# EAGLE design scld_winslow (EAGLE 6.4)
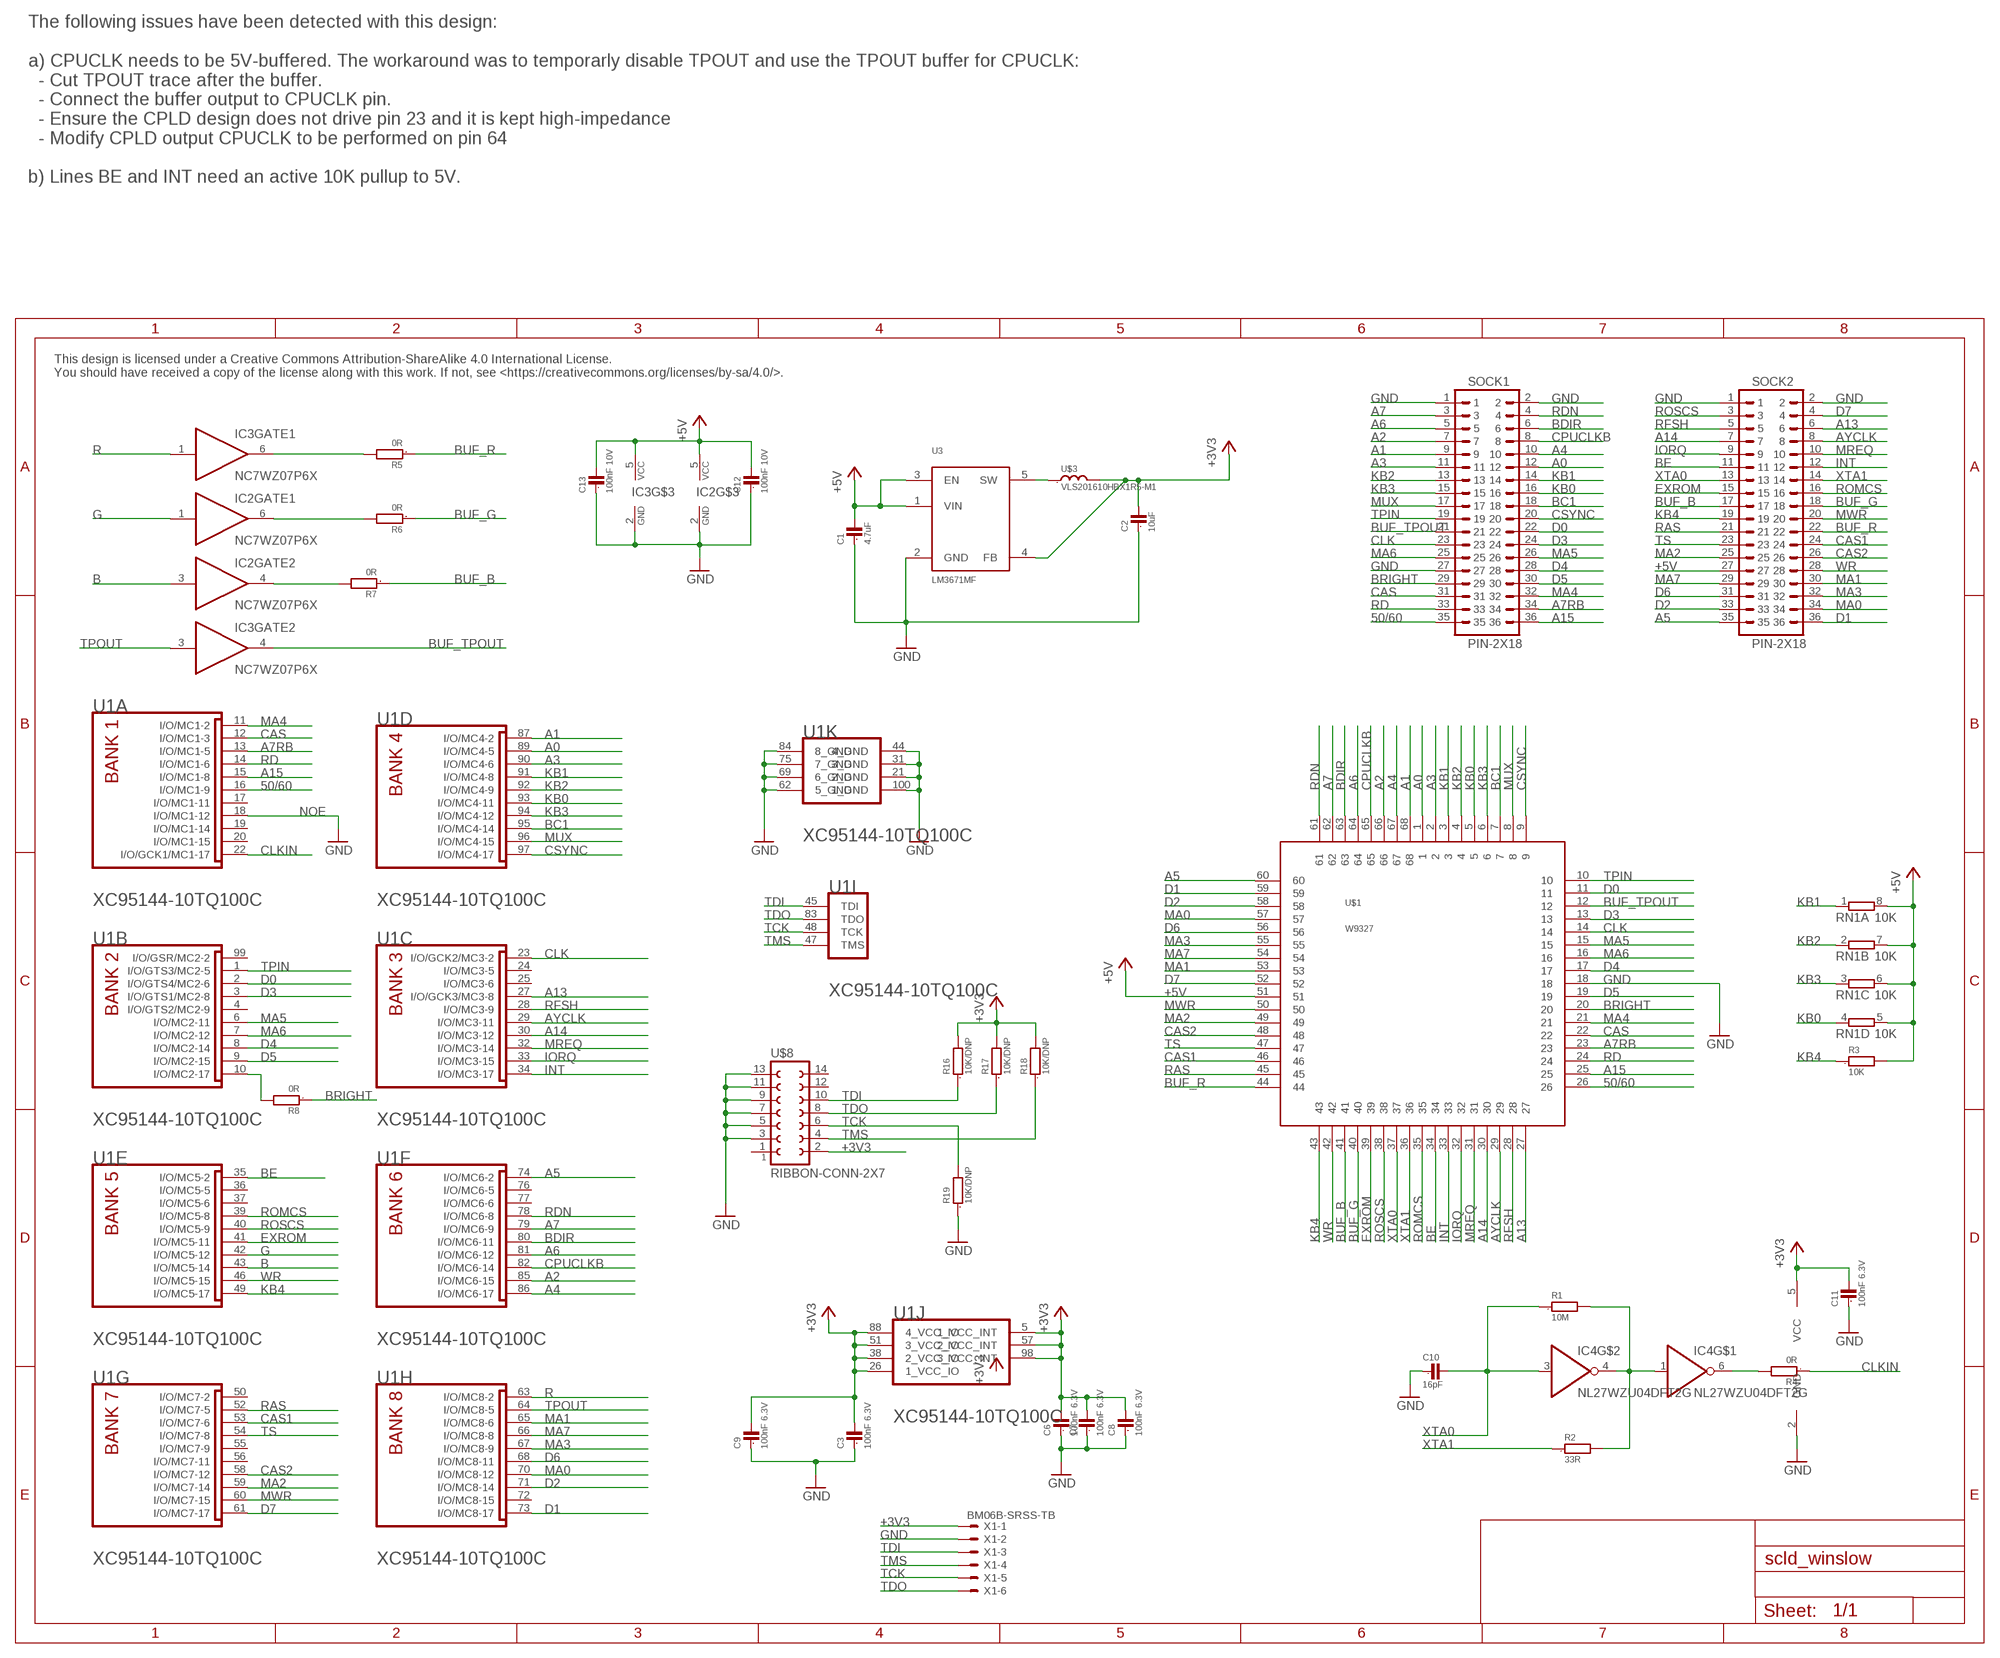
[diagram p0: schematic, sheet 1]

## Parts
C1  4.7uF  C0805  [0805]
C2  10uF  C0805  [0805]
C3  100nF 6.3V  C0402  [0402]
C6  100nF 6.3V  C0402  [0402]
C7  100nF 6.3V  C0402  [0402]
C8  100nF 6.3V  C0402  [0402]
C9  100nF 6.3V  C0402  [0402]
C10  16pF  C0402  [0402]
C11  100nF 6.3V  C0402  [0402]
C12  100nF 10V  C0402  [0402]
C13  100nF 10V  C0402  [0402]
IC2  NC7WZ07P6X  [SC70-6]
IC3  NC7WZ07P6X  [SC70-6]
IC4  NL27WZU04DFT2G  [SC70-6]
R1  10M  R0402  [0402]
R2  33R  R0402  [0402]
R3  10K  R0402  [0402]
R4  0R  R0603  [0603]
R5  0R  R0603  [0603]
R6  0R  R0603  [0603]
R7  0R  R0603  [0603]
R8  0R  R0603  [0603]
R16  10K/DNP  R0603  [0603]
R17  10K/DNP  R0603  [0603]
R18  10K/DNP  R0603  [0603]
R19  10K/DNP  R0603  [0603]
RN1  10K  4R-NEXB28V  [EXB28V]
SOCK1  PIN-2X18  [PIN-2X18]
SOCK2  PIN-2X18  [PIN-2X18]
U1  XILINX_XC95144-10TQ100CLQFP  [LQFP100]
U3  LM3671MF  [SOT23-5L]
U$1  W9327  [W9327]
U$3  VLS201610HBX1R5-M1  [IND_0806]
U$8  RIBBON-CONN-2X7  [RIBBON-CONN-2X7]
X1  BM06B-SRSS-TB  [BM06B-SRSS-TB]

## Nets
50/60: SOCK1.35 U1.16(A:I/O/MC1-9) U$1.26
+3V3: C2.2 C3.2 C6.2 C7.2 C8.2 C9.2 C11.2 IC4.5(VCC) R16.2 R17.2 R18.2 U1.5(J:1_VCC_INT) U1.26(J:1_VCC_IO) U1.38(J:2_VCC_IO) U1.51(J:3_VCC_IO) U1.57(J:2_VCC_INT) U1.88(J:4_VCC_IO) U1.98(J:3_VCC_INT) U3.4(FB) U$3.P$2 U$8.2 X1.1
+5V: C1.2 C12.2 C13.2 IC2.5(VCC) IC3.5(VCC) R3.2 RN1.5 RN1.6 RN1.7 RN1.8 SOCK2.27 U3.1(VIN) U3.3(EN) U$1.51
A0: SOCK1.12 U1.89(D:I/O/MC4-5) U$1.1
A1: SOCK1.9 U1.87(D:I/O/MC4-2) U$1.68
A2: SOCK1.7 U1.85(F:I/O/MC6-15) U$1.66
A3: SOCK1.11 U1.90(D:I/O/MC4-6) U$1.2
A4: SOCK1.10 U1.86(F:I/O/MC6-17) U$1.67
A5: SOCK2.35 U1.74(F:I/O/MC6-2) U$1.60
A6: SOCK1.5 U1.81(F:I/O/MC6-12) U$1.64
A7: SOCK1.3 U1.79(F:I/O/MC6-9) U$1.62
A7RB: SOCK1.34 U1.13(A:I/O/MC1-5) U$1.23
A13: SOCK2.6 U1.27(C:I/O/GCK3/MC3-8) U$1.27
A14: SOCK2.7 U1.30(C:I/O/MC3-12) U$1.30
A15: SOCK1.36 U1.15(A:I/O/MC1-8) U$1.25
AYCLK: SOCK2.8 U1.29(C:I/O/MC3-11) U$1.29
B: IC2.3(GATE2:I) U1.43(E:I/O/MC5-14)
BC1: SOCK1.18 U1.95(D:I/O/MC4-14) U$1.7
BDIR: SOCK1.6 U1.80(F:I/O/MC6-11) U$1.63
BE: SOCK2.11 U1.35(E:I/O/MC5-2) U$1.34
BRIGHT: R8.1 SOCK1.29 U$1.20
BUF_B: R7.1 SOCK2.17 U$1.41
BUF_G: R6.1 SOCK2.18 U$1.40
BUF_R: R5.1 SOCK2.22 U$1.44
BUF_TPOUT: IC3.4(GATE2:O) SOCK1.21 U$1.12
CAS: SOCK1.31 U1.12(A:I/O/MC1-3) U$1.22
CAS1: SOCK2.24 U1.53(G:I/O/MC7-6) U$1.46
CAS2: SOCK2.26 U1.58(G:I/O/MC7-12) U$1.48
CLK: SOCK1.23 U1.23(C:I/O/GCK2/MC3-2) U$1.14
CLKIN: R4.1 U1.22(A:I/O/GCK1/MC1-17)
CPUCLKB: SOCK1.8 U1.82(F:I/O/MC6-14) U$1.65
CSYNC: SOCK1.20 U1.97(D:I/O/MC4-17) U$1.9
D0: SOCK1.22 U1.2(B:I/O/GTS4/MC2-6) U$1.11
D1: SOCK2.36 U1.73(H:I/O/MC8-17) U$1.59
D2: SOCK2.33 U1.71(H:I/O/MC8-14) U$1.58
D3: SOCK1.24 U1.3(B:I/O/GTS1/MC2-8) U$1.13
D4: SOCK1.28 U1.8(B:I/O/MC2-14) U$1.17
D5: SOCK1.30 U1.9(B:I/O/MC2-15) U$1.19
D6: SOCK2.31 U1.68(H:I/O/MC8-11) U$1.56
D7: SOCK2.4 U1.61(G:I/O/MC7-17) U$1.52
EXROM: SOCK2.15 U1.41(E:I/O/MC5-11) U$1.39
G: IC2.1(GATE1:I) U1.42(E:I/O/MC5-12)
GND: C1.1 C2.1 C3.1 C6.1 C7.1 C8.1 C9.1 C10.1 C11.1 C12.1 C13.1 IC2.2(GND) IC3.2(GND) IC4.2(GND) R19.1 SOCK1.1 SOCK1.2 SOCK1.27 SOCK2.1 SOCK2.2 U1.18(A:I/O/MC1-12) U1.21(K:2_GND) U1.31(K:3_GND) U1.44(K:4_GND) U1.62(K:5_GND) U1.69(K:6_GND) U1.75(K:7_GND) U1.84(K:8_GND) U1.100(K:1_GND) U3.2(GND) U$1.18 U$8.3 U$8.5 U$8.7 U$8.9 U$8.11 U$8.13 X1.2
INT: SOCK2.12 U1.34(C:I/O/MC3-17) U$1.33
IORQ: SOCK2.9 U1.33(C:I/O/MC3-15) U$1.32
KB0: RN1.4 SOCK1.16 U1.93(D:I/O/MC4-11) U$1.5
KB1: RN1.1 SOCK1.14 U1.91(D:I/O/MC4-8) U$1.3
KB2: RN1.2 SOCK1.13 U1.92(D:I/O/MC4-9) U$1.4
KB3: RN1.3 SOCK1.15 U1.94(D:I/O/MC4-12) U$1.6
KB4: R3.1 SOCK2.19 U1.49(E:I/O/MC5-17) U$1.43
MA0: SOCK2.34 U1.70(H:I/O/MC8-12) U$1.57
MA1: SOCK2.30 U1.65(H:I/O/MC8-6) U$1.53
MA2: SOCK2.25 U1.59(G:I/O/MC7-14) U$1.49
MA3: SOCK2.32 U1.67(H:I/O/MC8-9) U$1.55
MA4: SOCK1.32 U1.11(A:I/O/MC1-2) U$1.21
MA5: SOCK1.26 U1.6(B:I/O/MC2-11) U$1.15
MA6: SOCK1.25 U1.7(B:I/O/MC2-12) U$1.16
MA7: SOCK2.29 U1.66(H:I/O/MC8-8) U$1.54
MREQ: SOCK2.10 U1.32(C:I/O/MC3-14) U$1.31
MUX: SOCK1.17 U1.96(D:I/O/MC4-15) U$1.8
MWR: SOCK2.20 U1.60(G:I/O/MC7-15) U$1.50
N$1: IC4.6(O) R4.2
N$2: R8.2 U1.10(B:I/O/MC2-17)
N$3: IC3.6(GATE1:O) R5.2
N$4: U3.5(SW) U$3.P$1
N$5: IC4.1(I) IC4.4(O) R1.2 R2.2
N$7: IC2.4(GATE2:O) R7.2
N$8: IC2.6(GATE1:O) R6.2
R: IC3.1(GATE1:I) U1.63(H:I/O/MC8-2)
RAS: SOCK2.21 U1.52(G:I/O/MC7-5) U$1.45
RD: SOCK1.33 U1.14(A:I/O/MC1-6) U$1.24
RDN: SOCK1.4 U1.78(F:I/O/MC6-8) U$1.61
RFSH: SOCK2.5 U1.28(C:I/O/MC3-9) U$1.28
ROMCS: SOCK2.16 U1.39(E:I/O/MC5-8) U$1.35
ROSCS: SOCK2.3 U1.40(E:I/O/MC5-9) U$1.38
TCK: R19.2 U1.48(I:TCK) U$8.6 X1.5
TDI: R16.1 U1.45(I:TDI) U$8.10 X1.3
TDO: R17.1 U1.83(I:TDO) U$8.8 X1.6
TMS: R18.1 U1.47(I:TMS) U$8.4 X1.4
TPIN: SOCK1.19 U1.1(B:I/O/GTS3/MC2-5) U$1.10
TPOUT: IC3.3(GATE2:I) U1.64(H:I/O/MC8-5)
TS: SOCK2.23 U1.54(G:I/O/MC7-8) U$1.47
WR: SOCK2.28 U1.46(E:I/O/MC5-15) U$1.42
XTA0: C10.2 IC4.3(I) R1.1 SOCK2.13 U$1.37
XTA1: R2.1 SOCK2.14 U$1.36
Unconnected: U1.4(B:I/O/GTS2/MC2-9) U1.17(A:I/O/MC1-11) U1.19(A:I/O/MC1-14) U1.20(A:I/O/MC1-15) U1.24(C:I/O/MC3-5) U1.25(C:I/O/MC3-6) U1.36(E:I/O/MC5-5) U1.37(E:I/O/MC5-6) U1.50(G:I/O/MC7-2) U1.55(G:I/O/MC7-9) U1.56(G:I/O/MC7-11) U1.72(H:I/O/MC8-15) U1.76(F:I/O/MC6-5) U1.77(F:I/O/MC6-6) U1.99(B:I/O/GSR/MC2-2) U$8.1 U$8.12 U$8.14

## Notes on the sheet
- The following issues have been detected with this design:
  
  a) CPUCLK needs to be 5V-buffered. The workaround was to temporarly disable TPOUT and use the TPOUT buffer for CPUCLK:
    - Cut TPOUT trace after the buffer.
    - Connect the buffer output to CPUCLK pin.
    - Ensure the CPLD design does not drive pin 23 and it is kept high-impedance
    - Modify CPLD output CPUCLK to be performed on pin 64
  
  b) Lines BE and INT need an active 10K pullup to 5V.
- This design is licensed under a Creative Commons Attribution-ShareAlike 4.0 International License.
  You should have received a copy of the license along with this work. If not, see <https://creativecommons.org/licenses/by-sa/4.0/>.
- NOE

## Library data of the parts
C1-C3 C6-C13 = GadgetFactory:C: CAPACITOR, European symbol
IC2 IC3 = GadgetFactory:NC7WZ07P6X: Dual line drivers with 3-state outputs.
IC4 = alvie:NL27WZU04
R1-R8 R16-R19 = GadgetFactory:R: RESISTOR, European symbol
RN1 = resistor-dil:4R-N: Array Chip Resistor Source: RS Component / Phycomp; OC_FARNELL: unknown; OC_NEWARK: unknown
SOCK1 SOCK2 = alvie:PIN-2X18
U1 = Xilinx - XC95144-10TQ100C:XILINX_XC95144-10TQ100C: PLD-XC9K-XC95144-SQ100A
U3 = alvie:LM3671
U$1 = alvie:W9327
U$3 = alvie:VLS201610HBX
U$8 = alvie:RIBBON-CONN-2X7
X1 = con-jst2:?M06B-SRSS-TB: Disconnectable Crimp style connector, 1.0mm pitch 6 contacts

## Board
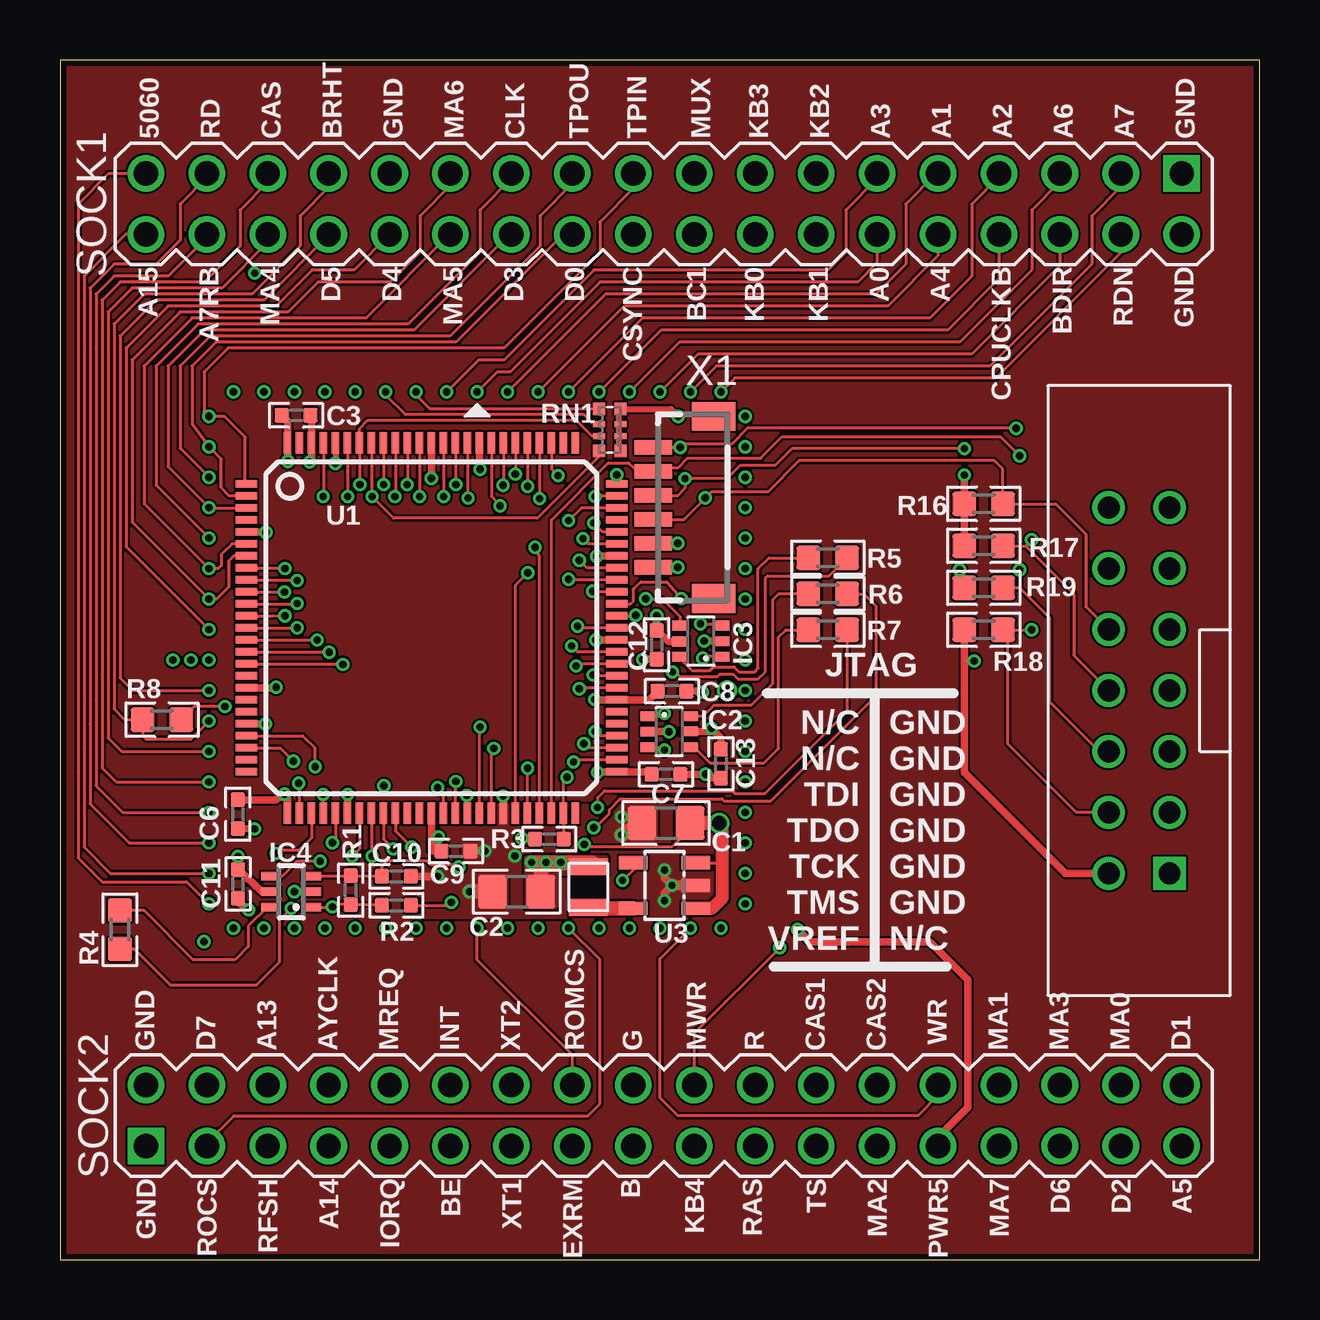
[diagram p1: board, top side]
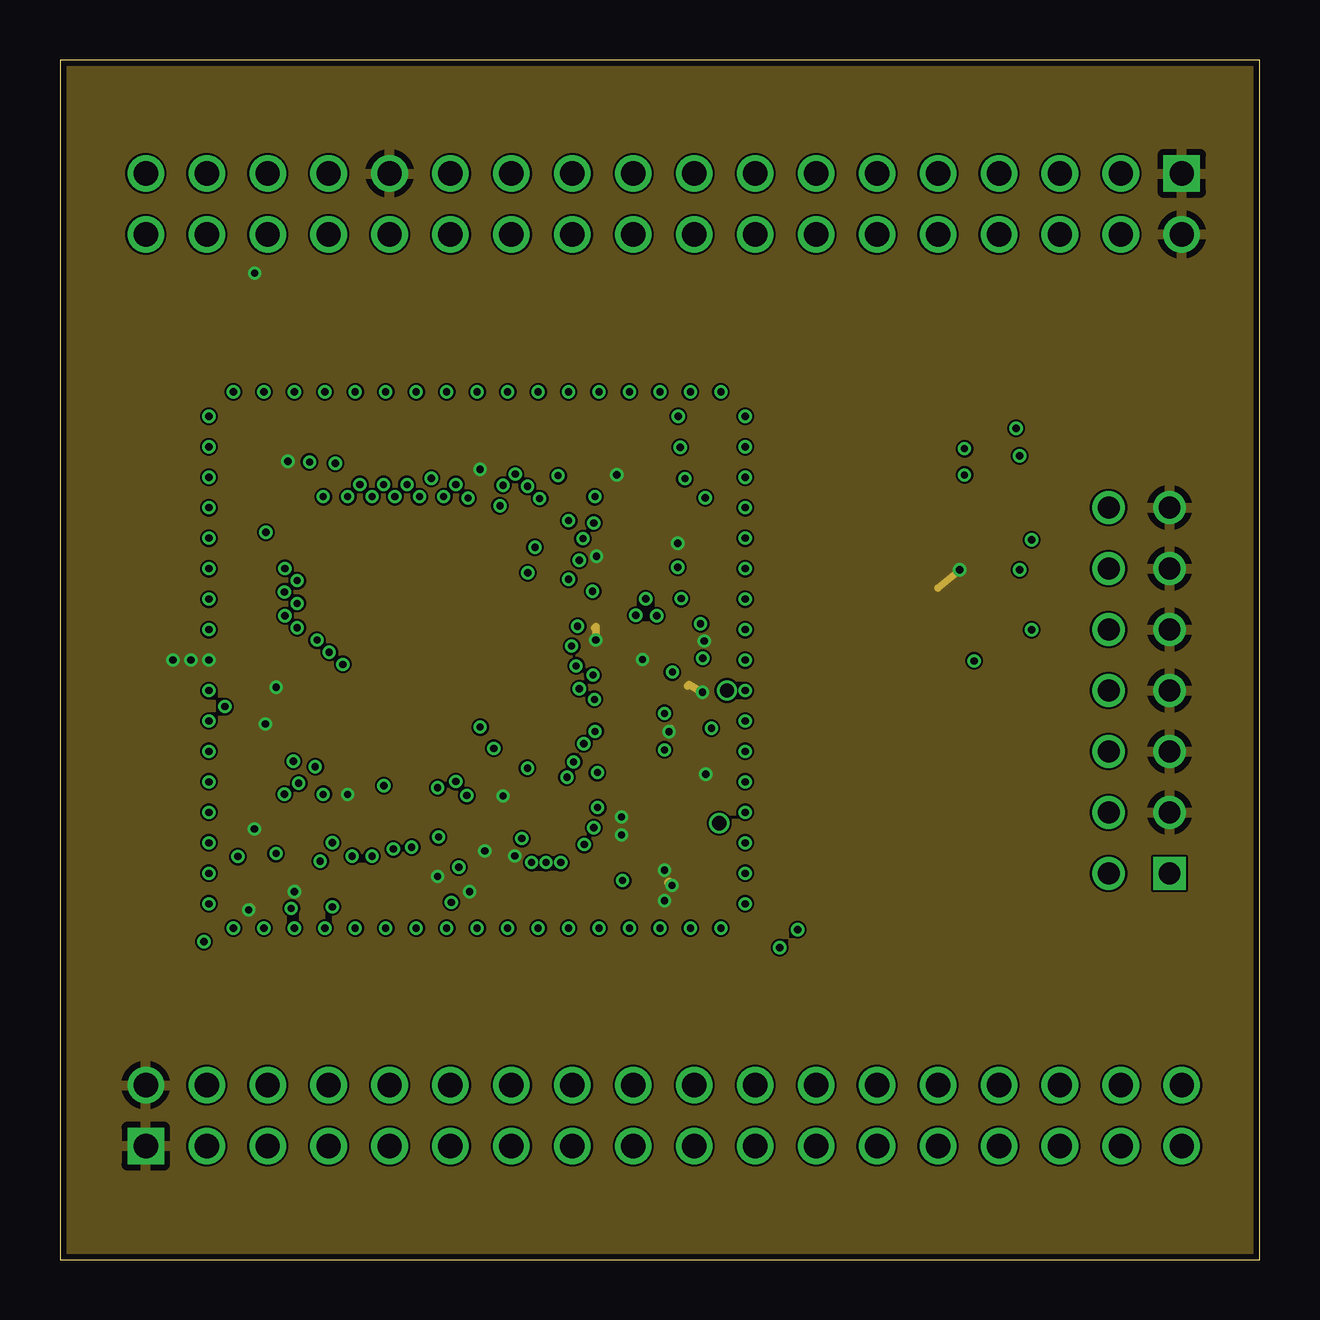
[diagram p2: board, inner layer Route2]
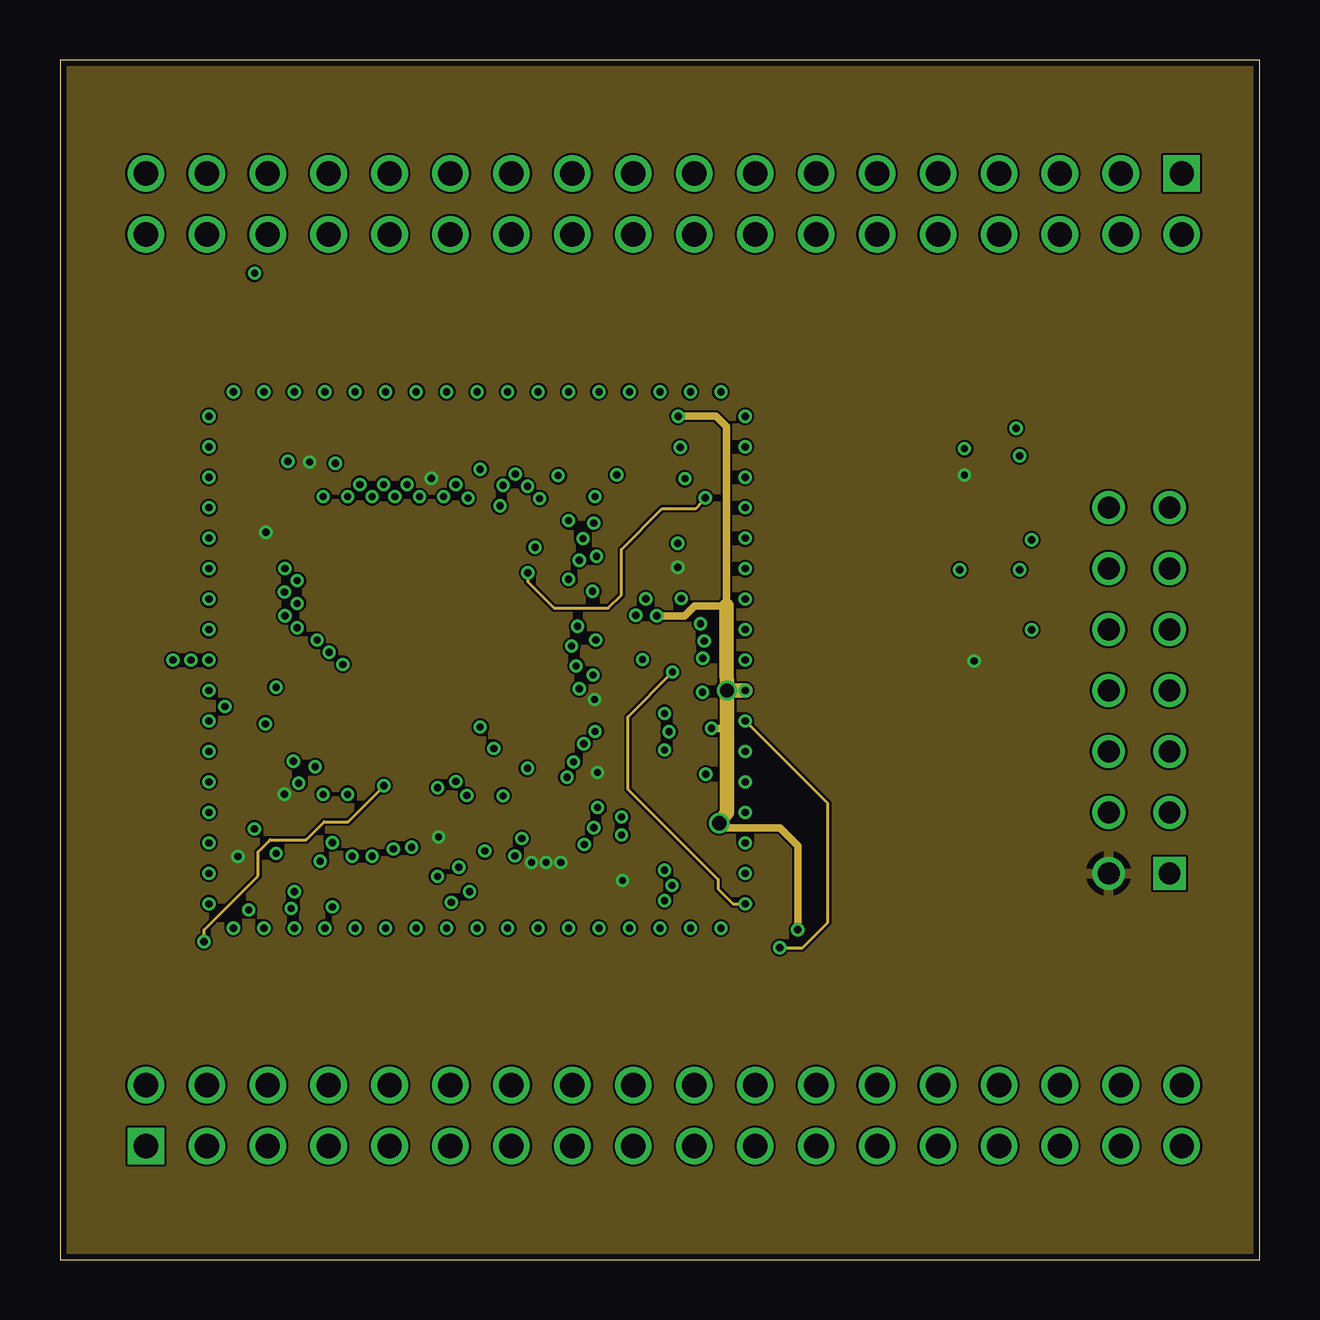
[diagram p3: board, inner layer Route15]
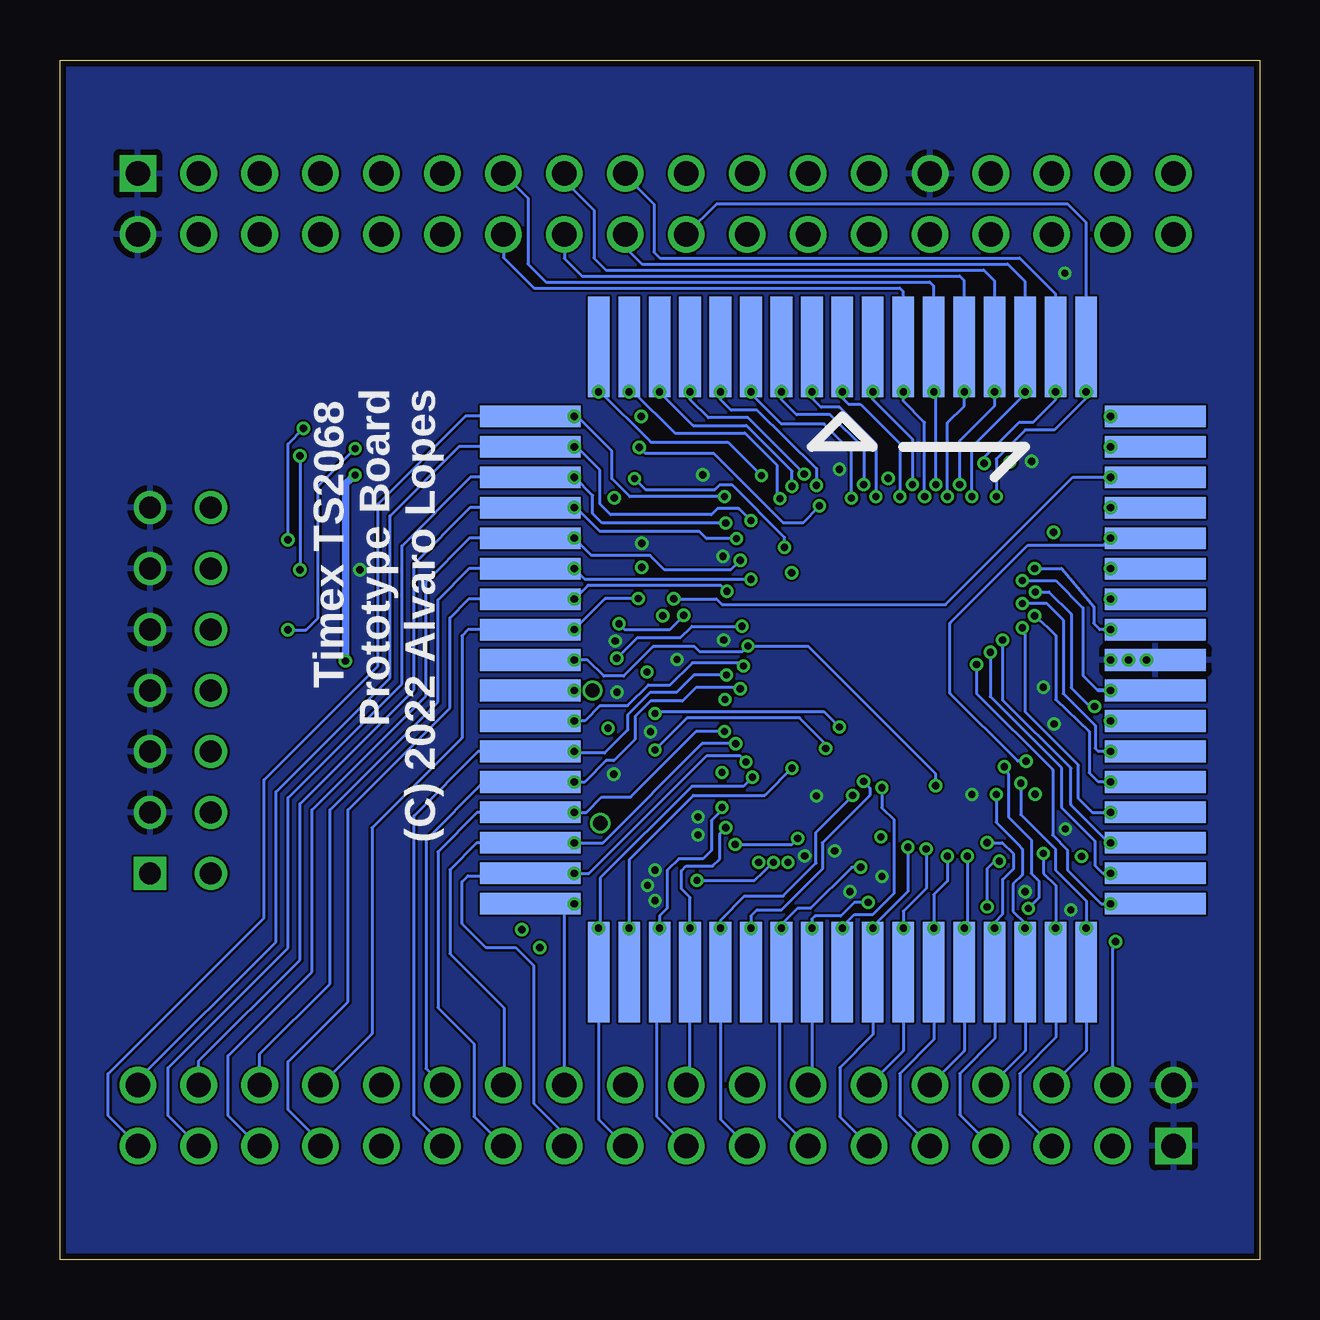
[diagram p4: board, bottom side, seen from below]

Size 50 x 50 mm. Coordinates in mm from the lower left corner, seen from the top.
Outline: 0,0 50,0 50,50 0,50 0,0
Copper layers (1*2*15*16): Top 0.035mm / dielectric 0.18mm / Route2 0.017mm / dielectric 1.12mm / Route15 0.017mm / dielectric 0.18mm / Bottom 0.035mm
Design rules "JLCPCB-FourLayerLayer *": minimum track width 3.5mil, minimum drill 0.2mm, track to track 3.5mil, track to pad 5mil, pad to pad 5mil, via to via 5mil, smd to smd 0mil, copper to edge 10mil, drill to drill 10mil, minimum pad ring 0.15mm, minimum via ring 0.125mm, stop-mask expansion 2mil, vias tented up to drill 100mil, thermal gap 10mil

### Footprints (pad centres in the part's own frame; a part is rotated, then mirrored left to right if it is on the bottom)
0805 = smd 1.2 x 1.4: 1 -1,0; 2 1,0
0402 = smd 0.6 x 0.6: 1 -0.6,0; 2 0.6,0
SC70-6 = smd 0.4 x 0.7: 1 -0.65,-0.85; 2 0,-0.85; 3 0.65,-0.85; 4 0.65,0.85; 5 -0.015,0.85; 6 -0.65,0.85
SC70-6' = smd 0.35 x 0.8: 1 -0.65,-0.85; 2 0,-0.85; 3 0.65,-0.85; 4 0.65,0.85; 5 0,0.85; 6 -0.65,0.85
0603 = smd 1 x 1: 1 -0.8,0; 2 0.8,0
EXB28V = smd 0.525 x 0.5: 1 -0.875,-0.45; 4 0.875,-0.45; 5 0.875,0.45; 8 -0.875,0.45 | smd 0.25 x 0.5: 2 -0.25,-0.45; 3 0.25,-0.45; 6 0.25,0.45; 7 -0.25,0.45
PIN-2X18 = drill 1.016 square: 1 -22.86,-1.27 | drill 1.016: 2 -22.86,1.27; 3 -20.32,-1.27; 4 -20.32,1.27; 5 -17.78,-1.27; 6 -17.78,1.27; 7 -15.24,-1.27; 8 -15.24,1.27; 9 -12.7,-1.27; 10 -12.7,1.27; 11 -10.16,-1.27; 12 -10.16,1.27; 13 -7.62,-1.27; 14 -7.62,1.27; 15 -5.08,-1.27; 16 -5.08,1.27; 17 -2.54,-1.27; 18 -2.54,1.27; 19 0,-1.27; 20 0,1.27; 21 2.54,-1.27; 22 2.54,1.27; 23 5.08,-1.27; 24 5.08,1.27; 25 7.62,-1.27; 26 7.62,1.27; 27 10.16,-1.27; 28 10.16,1.27; 29 12.7,-1.27; 30 12.7,1.27; 31 15.24,-1.27; 32 15.24,1.27; 33 17.78,-1.27; 34 17.78,1.27; 35 20.32,-1.27; 36 20.32,1.27
LQFP100 = smd 0.9 x 0.3: 1 -7.72,6; 2 -7.72,5.5; 3 -7.72,5; 4 -7.72,4.5; 5 -7.72,4; 6 -7.72,3.5; 7 -7.72,3; 8 -7.72,2.5; 9 -7.72,2; 10 -7.72,1.5; 11 -7.72,1; 12 -7.72,0.5; 13 -7.72,0; 14 -7.72,-0.5; 15 -7.72,-1; 16 -7.72,-1.5; 17 -7.72,-2; 18 -7.72,-2.5; 19 -7.72,-3; 20 -7.72,-3.5; 21 -7.72,-4; 22 -7.72,-4.5; 23 -7.72,-5; 24 -7.72,-5.5; 25 -7.72,-6; 51 7.72,-6; 52 7.72,-5.5; 53 7.72,-5; 54 7.72,-4.5; 55 7.72,-4; 56 7.72,-3.5; 57 7.72,-3; 58 7.72,-2.5; 59 7.72,-2; 60 7.72,-1.5; 61 7.72,-1; 62 7.72,-0.5; 63 7.72,0; 64 7.72,0.5; 65 7.72,1; 66 7.72,1.5; 67 7.72,2; 68 7.72,2.5; 69 7.72,3; 70 7.72,3.5; 71 7.72,4; 72 7.72,4.5; 73 7.72,5; 74 7.72,5.5; 75 7.72,6 | smd 0.3 x 0.9: 26 -6,-7.72; 27 -5.5,-7.72; 28 -5,-7.72; 29 -4.5,-7.72; 30 -4,-7.72; 31 -3.5,-7.72; 32 -3,-7.72; 33 -2.5,-7.72; 34 -2,-7.72; 35 -1.5,-7.72; 36 -1,-7.72; 37 -0.5,-7.72; 38 0,-7.72; 39 0.5,-7.72; 40 1,-7.72; 41 1.5,-7.72; 42 2,-7.72; 43 2.5,-7.72; 44 3,-7.72; 45 3.5,-7.72; 46 4,-7.72; 47 4.5,-7.72; 48 5,-7.72; 49 5.5,-7.72; 50 6,-7.72; 76 6,7.72; 77 5.5,7.72; 78 5,7.72; 79 4.5,7.72; 80 4,7.72; 81 3.5,7.72; 82 3,7.72; 83 2.5,7.72; 84 2,7.72; 85 1.5,7.72; 86 1,7.72; 87 0.5,7.72; 88 0,7.72; 89 -0.5,7.72; 90 -1,7.72; 91 -1.5,7.72; 92 -2,7.72; 93 -2.5,7.72; 94 -3,7.72; 95 -3.5,7.72; 96 -4,7.72; 97 -4.5,7.72; 98 -5,7.72; 99 -5.5,7.72; 100 -6,7.72
SOT23-5L = smd 0.55 x 1.2: 1 -0.95,-1.3; 2 0,-1.3; 3 0.95,-1.3; 4 0.95,1.3; 5 -0.95,1.3
W9327 = smd 0.9 x 4.2: 1 0,13.05; 2 1.27,13.05; 3 2.54,13.05; 4 3.81,13.05; 5 5.08,13.05; 6 6.35,13.05; 7 7.62,13.05; 8 8.89,13.05; 9 10.16,13.05; 27 10.16,-13.01; 28 8.89,-13.01; 29 7.62,-13.01; 30 6.35,-13.01; 31 5.08,-13.01; 32 3.81,-13.01; 33 2.54,-13.01; 34 1.27,-13.01; 35 0,-13.01; 36 -1.27,-13.01; 37 -2.54,-13.01; 38 -3.81,-13.01; 39 -5.08,-13.01; 40 -6.35,-13.01; 41 -7.62,-13.01; 42 -8.89,-13.01; 43 -10.16,-13.01; 61 -10.16,13.05; 62 -8.89,13.05; 63 -7.62,13.05; 64 -6.35,13.05; 65 -5.08,13.05; 66 -3.81,13.05; 67 -2.54,13.05; 68 -1.27,13.05 | smd 4.2 x 0.9: 10 13.05,10.16; 11 13.05,8.89; 12 13.05,7.62; 13 13.05,6.35; 14 13.05,5.08; 15 13.05,3.81; 16 13.05,2.54; 17 13.05,1.27; 18 13.05,0; 19 13.05,-1.27; 20 13.05,-2.54; 21 13.05,-3.81; 22 13.05,-5.08; 23 13.05,-6.35; 24 13.05,-7.62; 25 13.05,-8.89; 26 13.05,-10.16; 44 -13.01,-10.16; 45 -13.01,-8.89; 46 -13.01,-7.62; 47 -13.01,-6.35; 48 -13.01,-5.08; 49 -13.01,-3.81; 50 -13.01,-2.54; 51 -13.01,-1.27; 52 -13.01,0; 53 -13.01,1.27; 54 -13.01,2.54; 55 -13.01,3.81; 56 -13.01,5.08; 57 -13.01,6.35; 58 -13.01,7.62; 59 -13.01,8.89; 60 -13.01,10.16
IND_0806 = smd 0.7 x 1.6: P$1 -0.85,0; P$2 0.85,0
RIBBON-CONN-2X7 = drill 0.914 square: 1 -8.89,0 | drill 0.914: 2 -8.89,2.54; 3 -6.35,0; 4 -6.35,2.54; 5 -3.81,0; 6 -3.81,2.54; 7 -1.27,0; 8 -1.27,2.54; 9 1.27,0; 10 1.27,2.54; 11 3.81,0; 12 3.81,2.54; 13 6.35,0; 14 6.35,2.54
BM06B-SRSS-TB = smd 0.6 x 1.55: 1 2.5,-1.625; 2 1.5,-1.625; 3 0.5,-1.625; 4 -0.5,-1.625; 5 -1.5,-1.625; 6 -2.5,-1.625 | smd 1.2 x 1.8: FIT@1 3.8,0.9; FIT@2 -3.8,0.9

### Placement (x,y rotation side)
C1  25.26,18.19 0 top
C2  19.04,15.34 0 top
C3  9.85,35.19 0 top
C6  7.41,18.56 90 top
C7  25.26,20.23 180 top
C8  25.51,23.7 180 top
C9  16.5,17.03 180 top
C10  14.02,15.97 180 top
C11  7.42,15.65 90 top
C12  24.87,25.62 90 top
C13  27.55,20.67 90 top
IC2  25.39,22 270 top
IC3  26.71,25.78 90 top
IC4  NL27WZU04DFT2G  [SC70-6']  9.64,15.34 90 top
R1  12.12,15.4 270 top
R2  14.02,14.76 180 top
R3  20.4,17.53 180 top
R4  2.5,13.75 90 top
R5  32,29.25 180 top
R6  32,27.75 180 top
R7  32,26.25 180 top
R8  4.25,22.5 0 top
R16  38.5,31.5 180 top
R17  38.5,29.75 180 top
R18  38.5,26.25 180 top
R19  38.5,28 0 top
RN1  22.92,34.58 270 top
SOCK1  23.9,44 180 top
SOCK2  26.44,6 0 top
U1  15.48,26.33 0 top
U3  25.2,15.59 90 top
U$1  17.39,24.99 0 bottom
U$3  22.02,15.53 90 top
U$8  46.25,24.99 90 top
X1  26.35,31.35 270 top

### Tracks (layer width: path | path; a pad name or v marks a point on that pad's centre or on a via)
50/60  (via drill 0.3)
  Top 0.128: U1.16 11.52,24.83 v11.79,24.8 | SOCK1.35 2.02,45.27 0.75,44 0.75,20.29 0.75,16.75 1.75,15.75 5.28,15.75 v6.2,14.82 v6.21,14.83
  Bottom 0.128: v11.79,24.8 11.79,23.59 8.62,20.42 8.62,17.7 7.99,17.06 7.99,16.23 6.59,14.83 v6.21,14.83 U$1.26
+3V3  (via drill 0.3)
  Top 0.128: U3.4 23.9,16.25 v23.45,15.8
  Top 0.305: IC4.5 8.41,15.34 C11.2 v7.42,16.8 | U1.88 v15.48,32.56 | v10.4,33.24 10.48,33.32 U1.98 10.48,35.15 C3.2 | U1.26 9.49,19.21 v9.36,19.4 8.99,19.16 C6.2 | v22.4,20.3 22.44,20.33 U1.51 24.52,20.33 24.62,20.23 C7.2 | v22.28,23.34 22.29,23.33 U1.57 24.54,23.33 C8.2 | 15.48,17.81 v15.78,17.61 | U1.38 15.48,17.81 | 15.48,17.81 15.48,17.03 C9.2 | X1.1 v25.75,28.85 | U1.5 8.57,30.33 v8.59,30.32 | U$8.2 41.9,16.1 37.7,20.3 37.7,24.95 | R17.2 R16.2 v37.7,32.7 | R18.2 37.7,24.95 | 37.7,24.95 v38.1,24.95
  Top 0.61: 20.05,16.54 20.63,16.54 22.21,16.54 21.87,16.38 U$3.P$2 | 20.05,16.54 20.05,15.54 C2.2 | 20.05,16.54 v19.66,16.54 v19.66,16.55
  Route15 0.305: v7.42,16.8 7.41,16.8 | v25.75,28.85 25.8,28.85
  Bottom 0.128: v23.45,15.8 21.06,15.8 v20.26,16.55
  Bottom 0.305: v38.1,24.95 38.1,32.35 v37.7,32.7
  other vias: 20.87,16.55
  pour Top (no thermals): 19.4,14.7 19.4,16.75 19.45,16.8 22.75,16.8 22.8,16.75 22.8,16.1 22.75,16.05 20.75,16.05 20.7,16 20.7,14.7 20.65,14.65 19.45,14.65
  pour Route15: 0,50 50,50 50,0 0,0
+5V  (via drill 0.3, 0.6)
  Top 0.128: RN1.5 RN1.6 RN1.7 RN1.8 | C1.2 26.26,17.96 25.5,17.2 21.95,17.2 v21.85,17.3 | R3.2 19.27,17.53 v19.25,17.55 | U3.3 27.6,16.54 27.61,16.55
  Top 0.254: RN1.8 25.47,35.45 v25.77,35.15
  Top 0.305: IC2.5 27.1,22 27.09,22.02 v27.15,22.14 27.55,21.75 C13.2 | IC3.5 25.38,25.76 C12.2 v24.87,26.83 | SOCK2.27 36.6,5.1 37.85,6.35 37.85,11.65 36.25,13.25 31.25,13.25 v30.75,13.75
  Top 0.55: U3.1 27.17,14.64 27.61,15.08 27.61,16.55 27.61,17.88 v27.48,18.19
  Top 0.61: v27.48,18.19 C1.2
  Route15 0.254: v25.77,35.15
  Route15 0.305: v27.15,22.14 27.66,22.14 27.8,22.13 | v24.87,26.83 26.03,26.83 26.45,27.25 27.77,27.25 | 27.77,27.25 27.79,27.27 | 27.77,27.25 27.77,34.73 27.35,35.15 v25.77,35.15 | v30.75,13.75 30.75,17.25 30,18 27.68,18 v27.48,18.19
  Route15 0.6: v27.8,23.72 v28.56,23.72 v28.57,23.72
  Route15 0.61: v27.48,18.19 27.8,18.64 27.8,22.13 27.8,23.53 27.87,23.72 v27.8,23.72 27.79,24.73 27.79,27.27
  Bottom 0.128: v21.85,17.3 19.5,17.3 v19.25,17.55 | v28.56,23.72 U$1.51
A0  (via drill 0.3)
  Top 0.128: U1.89 v14.98,31.8 v14.99,31.8 | SOCK1.12 34.06,41.56 33.25,40.75 22.5,40.75 18.75,37 18.22,37 v17.39,36.16
  Bottom 0.128: v14.99,31.8 14.99,34.01 16.64,35.66 17.13,35.66 17.39,35.91 v17.39,36.16 U$1.1
A1  (via drill 0.3)
  Top 0.128: U1.87 v15.98,31.81 v15.99,31.8 | SOCK1.9 36.52,45.27 35.25,44 35.25,41.5 34,40.25 22.74,40.25 v18.66,36.16
  Bottom 0.128: v15.99,31.8 15.99,34.01 17.52,35.53 18.28,35.53 18.66,35.91 v18.66,36.16 U$1.68
A2  (via drill 0.3)
  Top 0.128: U1.85 16.98,31.76 v17.01,31.73 | SOCK1.7 39.14,45.14 38,44 38,41 36.25,39.25 24.28,39.25 v21.2,36.16
  Bottom 0.128: v17.01,31.73 17.01,33.69 18.15,34.83 19.93,34.83 21.2,36.1 v21.2,36.16 U$1.66
A3  (via drill 0.3)
  Top 0.128: 14.48,33.32 U1.90 14.48,32.32 v14.47,32.31 | SOCK1.11 34.06,45.06 32.75,43.75 32.75,42 32,41.25 22.25,41.25 18.5,37.5 17.45,37.5 v16.12,36.16
  Bottom 0.128: v14.47,32.31 14.47,34.2 16.12,35.85 v16.12,36.16 U$1.2
A4  (via drill 0.3)
  Top 0.128: U1.86 16.48,32.32 v16.5,32.31 | SOCK1.10 36.6,41.85 34.5,39.75 23.51,39.75 v19.93,36.16
  Bottom 0.128: v16.5,32.31 16.5,33.81 17.9,35.21 19.29,35.21 19.93,35.85 v19.93,36.16 U$1.67
A5  (via drill 0.3)
  Top 0.128: U1.74 22.33,31.83 v22.3,31.8
  Bottom 0.128: v22.3,31.8 26.25,31.8 27,32.55 27,33.7 28.45,35.15 v28.56,35.15 U$1.60 33.1,35.15 36.75,31.5 36.75,24.75 41.5,20 41.5,14.25 48,7.75 48,6 46.76,4.76 SOCK2.35
A6  (via drill 0.3)
  Top 0.128: 18.98,32.74 v18.98,32.73 18.98,32.74 U1.81 | SOCK1.5 41.68,44.93 40.5,43.75 40.5,41.25 37.5,38.25 25.82,38.25 v23.74,36.16
  Bottom 0.128: v18.98,32.73 21.32,35.08 22.98,35.08 23.74,35.85 v23.74,36.16 U$1.64
A7  (via drill 0.3)
  Top 0.128: U1.79 v19.98,31.73 v19.99,31.72 | SOCK1.3 44.22,44.72 43,43.5 43,41.5 38.75,37.25 27.36,37.25 v26.28,36.16
  Bottom 0.128: 20.11,31.86 v19.99,31.72 20.12,31.85 20.12,33.12 21.45,34.45 24.37,34.45 26.09,36.16 v26.28,36.16 U$1.62
A7RB  (via drill 0.3)
  Top 0.128: U1.13 v9.89,26.33 | SOCK1.34 6.12,42.62 5.75,42.25 4.5,41 2.25,41 1.5,40.25 1.5,38 1.5,23.35 1.5,19.75 2.61,18.64 v6.21,18.64
  Bottom 0.128: v9.89,26.33 9.77,26.21 9.77,22.83 7.54,20.61 7.54,19.21 6.97,18.64 v6.21,18.64 U$1.23
A13  (via drill 0.3)
  Top 0.128: U1.27 9.98,19.82 v9.95,19.85
  Bottom 0.128: v9.95,19.85 9.95,18.55 8.5,17.1 8.5,16.23 7.23,14.96 v7.23,13.81 U$1.27 7.23,8.7 SOCK2.6
A14  (via drill 0.3)
  Top 0.128: U1.30 11.48,17.5 v11.35,17.37
  Bottom 0.128: v11.35,17.37 10.72,17.37 10.25,16.9 10.25,16.3 10.7,15.85 10.7,14.4 11.04,14.06 v11.04,13.81 U$1.30 11.04,9.21 12.5,7.75 12.5,6.03 SOCK2.7
A15  (via drill 0.3)
  Top 0.128: U1.15 11.2,25.33 v11.22,25.31 | SOCK1.36 2.73,42.73 1,41 1,21.31 1,17.2 2.1,16.1 v6.21,16.1
  Bottom 0.128: v11.22,25.31 11.22,23.46 8.24,20.48 8.24,18.82 6.85,17.43 6.85,16.42 6.53,16.1 v6.21,16.1 U$1.25
AYCLK  (via drill 0.3)
  Top 0.128: U1.29 10.98,18.58 10.97,18.87 v10.97,19.39
  Bottom 0.128: v10.97,19.39 10.97,18.22 10.1,17.35 9.89,17.11 9.89,16.04 10.28,15.65 10.28,14.51 9.77,14 v9.77,13.81 U$1.29 9.77,8.7 SOCK2.8
B  (via drill 0.3)
  Top 0.128: U1.43 17.98,21.2 v18.09,21.3 | IC2.3 25.09,21.35 v25.2,21.24
  Bottom 0.128: v25.2,21.24 23.86,22.58 19.17,22.58 18.09,21.5 v18.09,21.3
BC1  (via drill 0.3)
  Top 0.128: 11.98,32.87 v11.99,31.8 11.98,32.81 U1.95
  Bottom 0.128: v11.99,31.8 11.99,33.87 9.77,36.09 v9.77,36.16 U$1.7 9.77,40.77 10.5,41.5 25.75,41.5 26.44,42.19 SOCK1.18
BDIR  (via drill 0.3)
  Top 0.128: U1.80 v19.48,32.23 | v19.48,32.23 | SOCK1.6 41.68,41.43 38,37.75 26.59,37.75 v25.01,36.16
  Bottom 0.128: v19.48,32.23 19.48,32.86 21.39,34.77 23.61,34.77 v25.01,36.16 U$1.63
BE  (via drill 0.3)
  Top 0.128: U1.35 13.98,17.86 v14.66,17.19
  Bottom 0.128: v14.66,17.19 14.66,15.34 16.12,13.88 v16.12,13.81 U$1.34 16.12,9.38 17.5,8 17.5,5.95 SOCK2.11
BRIGHT  (via drill 0.3)
  Top 0.128: SOCK1.29 11.2,44.7 10,43.5 10,42.25 8,40.25 3.5,40.25 2.25,39 2.25,22.95 2.7,22.5 R8.1 3.45,21.82 3.58,21.7 5.46,21.7 v6.21,22.45
  Bottom 0.128: 6.21,22.47 v6.21,22.45 U$1.20
BUF_B  (via drill 0.3)
  Top 0.128: v22.41,18.84 22.4,19.25 22.69,19.54 28.01,19.54 28.12,19.43 29.38,19.43 32.8,22.85 R7.1
  Bottom 0.128: v22.41,18.84 22.41,18.74 22.85,18.3 22.85,17.05 23.2,16.7 24.2,16.7 24.68,16.23 24.68,14.65 25.01,14.32 v25.01,13.81 U$1.41 25.12,11.86 25.12,5.96 SOCK2.17
BUF_G  (via drill 0.3)
  Top 0.128: v22.25,18 22.3,18 22.9,18.6 22.9,18.75 23.35,19.2 27.6,19.2 27.68,19.12 29.62,19.12 34,23.5 34,27.25 33.5,27.75 R6.1
  Bottom 0.128: SOCK2.18 23.74,7.43 U$1.40 v23.74,13.81 23.74,15.09 24.1,15.45 24.1,16.2 23.9,16.4 22.8,16.4 22.5,16.7 22.5,17.75 v22.25,18
BUF_R  (via drill 0.3)
  Top 0.128: v25.53,24.48 25.67,24.48 25.85,24.3 27.4,24.3 27.5,24.4 28.05,24.4 28.25,24.2 29.1,24.2 29.4,24.5 29.4,28.4 29.5,28.5 32.05,28.5 R5.1
  Route15 0.128: v25.53,24.48 23.67,22.62 23.67,19.6 27.43,15.84 27.43,15.46 28.06,14.83 v28.56,14.83 28.82,14.83
  Bottom 0.128: v28.56,14.83 29.25,14.83 | 29.25,14.83 U$1.44 | SOCK2.22 28.98,14.56 29.25,14.83
BUF_TPOUT  (via drill 0.3)
  Top 0.128: v24.41,27.54 25.11,27.54 25.86,26.79 IC3.4 | SOCK1.21 21.36,44.86 20,43.5 20,42.25 16.25,38.5 6.25,38.5 5,37.25 5,33.82 v6.21,32.61
  Bottom 0.128: v24.41,27.54 22.64,27.54 22.4,27.3 13.09,27.3 7.78,32.61 v6.21,32.61 U$1.12
CAS  (via drill 0.3)
  Top 0.128: U1.12 8.87,26.83 v9.38,26.84 | SOCK1.31 8.66,44.91 7.5,43.75 7.5,42.25 6,40.75 2.5,40.75 1.75,40 1.75,24.37 1.75,20.5 2.34,19.91 v6.21,19.91
  Bottom 0.128: v9.38,26.84 8.82,26.34 8.5,26.02 8.5,23.34 7.1,22 7.1,20.29 6.72,19.91 v6.21,19.91 U$1.22
CAS1  (via drill 0.3)
  Top 0.128: U1.53 22.01,21.33 v21.83,21.5
  Bottom 0.128: v21.83,21.5 23.23,21.5 27.37,17.37 v28.56,17.37 U$1.46 32.63,17.37 33.75,16.25 33.75,12.75 31.5,10.5 31.5,7.29 SOCK2.24
CAS2  (via drill 0.3)
  Top 0.128: U1.58 21.73,23.83 v21.64,23.79
  Bottom 0.128: v21.64,23.79 21.96,23.85 23.48,23.85 24.06,23.27 25.39,23.27 26.02,22.64 26.02,21.69 26.91,20.8 27.23,20.8 28.12,19.91 v28.56,19.91 U$1.48 32.34,19.91 34.75,17.5 34.75,7.96 SOCK2.26
CLK  (via drill 0.3)
  Top 0.128: SOCK1.23 18.82,45.07 17.5,43.75 17.5,42 14.5,39 5.75,39 4,37.25 4,32.28 v6.21,30.07 | U1.23 9.17,21.33 v9.72,20.77
  Bottom 0.128: U$1.14 v6.21,30.07 6.5,29.77 9.65,29.77 12.9,26.52 12.9,23.6 10.07,20.77 v9.72,20.77
CLKIN  (via drill 0.3)
  Top 0.128: U1.22 10.12,21.83 10.64,21.31 v10.64,20.54 | R4.1 3.1,12.95 4.6,11.45 8.2,11.45 9.15,12.4 9.15,14.15 v9.64,14.64
  Bottom 0.128: v10.64,20.54 10.47,20.22 10.47,18.45 9.51,17.5 9.51,16.1 9.2,15.78 9.2,15.08 v9.64,14.64
CPUCLKB  (via drill 0.3)
  Top 0.128: U1.82 18.48,32.28 v18.47,32.27 | SOCK1.8 39.14,40.89 37,38.75 25.05,38.75 v22.47,36.16
  Bottom 0.128: v18.47,32.27 18.46,32.97 20.94,35.4 22.02,35.4 22.47,35.85 v22.47,36.16 U$1.65
CSYNC  (via drill 0.3)
  Top 0.128: U1.97 10.98,31.81 v10.97,31.8
  Bottom 0.128: v10.97,31.8 10.97,33.37 9.77,34.58 8.56,34.58 7.23,35.91 v7.23,36.16 U$1.9 7.23,43.23 8,44 22.63,44 SOCK1.20
D0  (via drill 0.3)
  Top 0.128: U1.2 7.06,31.83 6.72,32.17 6.72,33.37 v6.21,33.88 5.5,34.84 5.5,37.25 6.5,38.25 16.5,38.25 20.98,42.73 SOCK1.22
  Bottom 0.128: U$1.11 v6.21,33.88
D1  (via drill 0.3)
  Top 0.128: U1.73 21.73,31.33 v21.2,30.8
  Bottom 0.128: v21.2,30.8 21.7,31.3 22.6,31.3 22.85,31.05 27.05,31.05 27.5,31.5 27.5,32.9 28.48,33.88 v28.56,33.88 U$1.59 33.37,33.88 36.25,31 36.25,24.25 41,19.5 41,13.25 46.76,7.49 SOCK2.36
D2  (via drill 0.3)
  Top 0.128: U1.71 22.62,30.33 v22.25,30.7
  Bottom 0.128: v22.25,30.7 27.4,30.7 27.8,31.1 27.8,31.85 v28.56,32.61 U$1.58 32.89,32.61 35.75,29.75 35.75,24 40.5,19.25 40.5,13 45.5,8 45.5,6 SOCK2.33
D3  (via drill 0.3)
  Top 0.128: U1.3 v6.22,31.33 v6.21,31.34 4.5,33.05 4.5,37.25 6,38.75 14.75,38.75 18.73,42.73 SOCK1.24
  Bottom 0.128: U$1.13 v6.21,31.34
D4  (via drill 0.3)
  Top 0.128: U1.8 9.36,28.83 v9.38,28.81 | SOCK1.28 12.25,41.25 10.5,41.25 9,39.75 4.5,39.75 2.75,38 2.75,29.72 v6.21,26.26
  Bottom 0.128: v9.38,28.81 8.24,28.81 6.91,27.23 6.91,26.51 6.66,26.26 v6.21,26.26 U$1.17
D5  (via drill 0.3)
  Top 0.128: U1.9 9.86,28.33 v9.89,28.3 | SOCK1.30 11.2,42.7 8.5,40 4,40 2.5,38.5 2.5,24.25 3.03,23.72 v6.21,23.72
  Bottom 0.128: 6.75,23.75 7.36,24.35 7.36,27.16 8.49,28.3 v9.89,28.3 | 6.75,23.75 6.72,23.72 v6.21,23.72 | U$1.19 4.37,23.75 6.75,23.75
D6  (via drill 0.3)
  Top 0.128: U1.68 21.97,28.83 v21.65,29.15
  Bottom 0.128: v21.65,29.15 22.05,28.75 24.8,28.75 25.4,29.35 27.85,29.35 v28.56,30.07 U$1.56 32.93,30.07 34.75,28.25 34.75,23.5 39.5,18.75 39.5,12 43,8.5 43,6 41.73,4.73 SOCK2.31
D7  (via drill 0.3)
  Top 0.128: U1.61 21.56,25.33 v21.32,25.57
  Route15 0.128: v6,13.25 6,13.75 8.25,16 8.25,17 8.75,17.5 10.25,17.5 11,18.25 12,18.25 v13.5,19.75
  Bottom 0.128: U$1.52 v28.56,24.99 28,24.99 27.33,24.32 26.51,24.32 25.28,25.55 23.55,25.55 23.35,25.35 21.54,25.35 v21.32,25.57 18.82,25.57 13.5,20.25 v13.5,19.75 | SOCK2.4 6.12,13.13 v6,13.25
EXROM  (via drill 0.3)
  Top 0.128: U1.41 16.98,19.25 v16.96,19.34
  Bottom 0.128: v16.96,19.34 18.48,17.81 18.48,16.53 19.86,15.15 21.46,15.15 22.47,14.15 v22.47,13.81 U$1.39 22.47,5.84 SOCK2.15
G  (via drill 0.3)
  Top 0.128: IC2.1 25.02,22.65 v25.2,22.77 | U1.42 17.48,22.16 v17.52,22.19
  Bottom 0.128: v17.52,22.19 18.16,22.84 25.13,22.84 v25.2,22.77
GND  (via drill 0.3)
  Top 0.305: IC4.2 v9.77,15.34 | U1.84 17.48,32.97 v17.52,32.93 | U1.21 8.46,22.33 v8.57,22.33 | C11.1 7.42,14.89 v7.86,14.57 | U1.31 v11.98,19.38 v11.99,19.39 | U1.44 18.48,19.21 v18.47,19.33 | IC2.2 v25.39,22 | C8.1 26.65,23.7 26.78,23.68 v26.78,23.64 | U1.62 22.47,25.83 v22.34,25.82 | C12.1 24.53,25.02 v24.28,25.01 | IC3.2 v26.86,25.78 | U1.69 22.43,29.33 v22.36,29.31 | C9.1 v17.71,17.03 | U1.75 23.19,32.83 v23.2,32.71 | v9.5,33.27 9.48,33.47 U1.100 9.48,34.95 C3.1 | C13.1 27.07,20.07 v26.91,20.23 C7.1 | v25.2,16.23 25.2,15.91 v25.52,15.59 25.2,15.27 v25.2,14.96 | U1.18 8.86,23.83 v9.01,23.85 | C10.1 v15.74,15.97 | X1.2 v25.75,29.85 | C6.1 7.66,17.96 v8.1,17.95 | R19.1 v37.5,28.75
  Top 0.406: U3.2 v25.52,15.59
  Top 0.6: C1.1 v23.41,17.69
  Top 0.61: C2.1 v17.07,15.34
  Route2 0.305: v9.77,15.34 9.83,15.46 9.89,15.4 | v7.86,14.57 7.99,14.64 7.93,14.7 | v11.99,19.39 11.99,19.37 | v25.39,22 25.45,22.13 | v26.78,23.64 26.21,23.97 26.15,23.91 | v22.34,25.82 22.34,26.39 22.28,26.32 | v23.2,32.71 23.21,32.74 | v26.91,20.23 26.85,20.29 | v25.75,29.85 25.85,29.85 | v37.5,28.75 36.6,28
  Route2 0.406: v25.52,15.59 25.39,15.72
  Bottom 0.128: U$1.18 v6.21,24.99
  other vias: 18.96,16.83 23.41,18.44 5.46,24.99 4.71,24.99 8.11,41.11
  pour Route2 (rank 2): 7.33,16.68 7.33,36.93 23.83,36.93 23.83,16.68
  pour Top (rank 2, no thermals): 15.2,14.25 15.2,18.2 28.1,18.2 28.1,14.25
  pour Top (rank 2, no thermals): 15.2,15 15.2,18.95 28.1,18.95 28.1,15
  pour Route2: 0,50 50,50 50,0.25 0,0.25
  pour Bottom (rank 3): 0,50 50,50 50,0 0,0
INT  (via drill 0.3)
  Top 0.128: U1.34 13.48,17.52 v13.9,17.11
  Bottom 0.128: v13.9,17.11 13.9,15.46 14.85,14.51 v14.85,13.81 U$1.33 14.85,8.7 SOCK2.12
IORQ  (via drill 0.3)
  Top 0.128: U1.33 12.98,16.84 v13.01,16.81
  Bottom 0.128: v13.01,16.81 13.01,15.78 13.58,15.21 v13.58,13.81 U$1.32 13.58,9.17 15,7.75 15,5.99 SOCK2.9
KB0  (via drill 0.3)
  Top 0.128: RN1.4 22.47,33.47 19.91,30.91 13.9,30.91 v13.01,31.8 12.98,31.82 U1.93
  Bottom 0.128: v13.01,31.8 13.01,34.88 12.31,35.58 v12.31,36.16 U$1.5 12.31,40.81 12.5,41 28.25,41 28.98,41.73 SOCK1.16
KB1  (via drill 0.3)
  Top 0.128: RN1.1 22.45,35.47 15.41,35.47 14.85,36.03 v14.85,36.16 | U1.91 13.98,31.82 v13.96,31.8
  Bottom 0.128: v13.96,31.8 13.96,34.89 14.85,35.78 v14.85,36.16 U$1.3 14.85,40.35 15,40.5 30.25,40.5 31.52,41.77 SOCK1.14
KB2  (via drill 0.3)
  Top 0.128: RN1.2 22.17,34.88 21.83,35.22 14.4,35.22 13.58,36.04 v13.58,36.16 | U1.92 v13.48,32.31 v13.49,32.31
  Bottom 0.128: v13.49,32.31 13.49,36.08 | 13.49,36.08 13.49,36.33 | 13.49,36.08 v13.58,36.16 U$1.4 13.58,40.58 13.75,40.75 29.75,40.75 30.5,41.5 30.5,44.25 SOCK1.13
KB3  (via drill 0.3)
  Top 0.128: RN1.3 22.17,34.33 21.53,34.96 12.81,34.96 12.48,34.63 U1.94 12.48,32.32 v12.5,32.31
  Bottom 0.128: v12.5,32.31 12.5,34.13 11.04,35.59 v11.04,36.16 U$1.6 11.04,40.79 11.5,41.25 27.25,41.25 27.75,41.75 27.75,43.75 28.98,44.98 SOCK1.15
KB4  (via drill 0.3)
  Top 0.128: v21.13,20.1 20.98,19.95 U1.49 20.98,18.25 R3.1
  Bottom 0.128: v21.13,20.1 21.51,19.73 23.66,19.73 27.48,15.9 27.48,14 | 27.48,14 27.48,13.62 | 27.48,14 27.55,13.94 v27.55,13.81 U$1.43 27.55,5.84 SOCK2.19
MA0  (via drill 0.3)
  Top 0.128: U1.70 22.02,29.83 v21.8,30.05
  Bottom 0.128: v21.8,30.05 23.05,30.05 23.35,30.35 27.5,30.35 28.49,31.34 v28.56,31.34 U$1.57 32.91,31.34 35.25,29 35.25,23.75 40,19 40,12.5 44.22,8.28 SOCK2.34
MA1  (via drill 0.3)
  Top 0.128: U1.65 23.78,27.33 23.9,27.45 23.9,27.95 24.2,28.25 25.3,28.25 v25.9,27.55
  Bottom 0.128: v25.9,27.55 27.27,27.55 v28.56,26.26 U$1.53 32.99,26.26 33.25,26 33.25,21.75 37,18 37,9.41 SOCK2.30
MA2  (via drill 0.3)
  Top 0.128: U1.59 22.25,24.33 v22.21,24.36
  Bottom 0.128: v22.21,24.36 23.58,24.36 24.3,23.64 25.4,23.64 26.34,22.7 26.34,22.07 27.29,21.11 28.5,21.11 v28.56,21.18 U$1.49 32.57,21.18 35.25,18.5 35.25,6 34.06,4.81 SOCK2.25
MA3  (via drill 0.3)
  Top 0.128: U1.67 21.27,28.33 v21.2,28.35
  Bottom 0.128: v21.2,28.35 28.12,28.35 v28.56,28.8 U$1.55 32.95,28.8 34.25,27.5 34.25,23.25 38.75,18.75 38.75,11.5 41.68,8.57 SOCK2.32
MA4  (via drill 0.3)
  Top 0.128: U1.11 9.62,27.33 v9.89,27.35 | SOCK1.32 8.66,42.41 6.75,40.5 3,40.5 2,39.5 2,25.39 2,21.75 2.57,21.18 v6.21,21.18
  Bottom 0.128: v9.89,27.35 8.87,27.35 8.18,26.66 8.18,23.59 6.85,22.26 6.85,21.3 6.72,21.18 v6.21,21.18 U$1.21
MA5  (via drill 0.3)
  Top 0.128: U1.6 7.17,29.83 6.72,29.38 6.72,28.93 6.59,28.8 v6.21,28.8 3.5,31.51 3.5,37.25 5.5,39.25 12.75,39.25 16.23,42.73 SOCK1.26
  Bottom 0.128: U$1.15 v6.21,28.8
MA6  (via drill 0.3)
  Top 0.128: U1.7 7.24,29.33 7.04,29.12 7.04,28.04 6.53,27.53 v6.21,27.53 3,30.74 3,37.5 5,39.5 9.5,39.5 10.75,40.75 13.75,40.75 15,42 15,43.5 16.28,44.78 SOCK1.25
  Bottom 0.128: U$1.16 v6.21,27.53
MA7  (via drill 0.3)
  Top 0.128: U1.66 22.37,27.83 v22.2,27.85
  Bottom 0.128: v22.2,27.85 22.45,28.1 28,28.1 28.25,27.85 28.24,27.85 v28.56,27.53 U$1.54 32.97,27.53 33.75,26.75 33.75,23 38,18.75 38,10.75 40.5,8.25 40.5,6.25 39.14,4.89 SOCK2.29
MREQ  (via drill 0.3)
  Top 0.128: U1.32 12.48,17.11 v12.18,16.81
  Bottom 0.128: v12.18,16.81 12.18,13.75 | 12.18,13.75 12.18,13.69 | 12.18,13.75 12.24,13.81 v12.31,13.81 U$1.31 12.31,8.7 SOCK2.10
MUX  (via drill 0.3)
  Top 0.128: U1.96
  Top 0.254: U1.96 v11.48,33.18
  Bottom 0.128: v11.48,33.18 11.48,33.43 10.02,34.89 9.45,34.89 8.5,35.85 v8.5,36.16 U$1.8 8.5,40.25 10,41.75 25,41.75 25.25,42 25.25,44 26.44,45.19 SOCK1.17
MWR  (via drill 0.3)
  Top 0.128: U1.60 21.6,24.83 v21.52,24.74 | SOCK2.20 26.44,9.44 v30,13
  Route15 0.128: v30,13 30.95,13 32,14.05 32,19.01 v28.56,22.45
  Bottom 0.128: v21.52,24.74 21.64,24.87 23.64,24.87 24.56,23.95 25.48,23.95 26.34,23.09 27.48,23.09 28.12,22.45 v28.56,22.45 U$1.50
N$1
  Top 0.128: IC4.6 8.64,14.69 7.85,13.9 7.85,13.05 7.3,12.5 5.55,12.5 3.5,14.55 R4.2
N$2  (via drill 0.3)
  Top 0.128: U1.10 v9.35,27.83 v9.35,27.82 | v6.88,23.05 5.6,23.05 R8.2
  Bottom 0.128: v9.35,27.82 8.78,27.82 7.85,26.9 7.85,23.82 7.08,23.05 v6.88,23.05
N$3
  Top 0.128: IC3.6 25.86,25.04 26.35,24.55 27.1,24.55 27.25,24.7 28.1,24.7 28.3,24.5 28.95,24.5 29.1,24.65 29.1,28.8 29.55,29.25 R5.2
N$4
  Top 0.61: U3.5 22.12,14.64 U$3.P$1
N$5  (via drill 0.3)
  Top 0.128: IC4.4 9.28,15.99 9.89,16.61 v10.85,16.61 | 10.59,14.58 IC4.1 11.34,14.69 v11.36,14.7 11.45,14.8 R1.2 13.39,14.8 R2.2
  Bottom 0.128: v11.36,14.7 11.36,16.29 11.04,16.61 v10.85,16.61
N$6
  pour Top (rank 3): 0,50 50,50 50,0 0,0
N$7
  Top 0.128: IC2.4 26.45,21.35 27.1,20.7 29.35,20.7 29.95,21.3 29.95,25.95 30.25,26.25 R7.2
N$8
  Top 0.128: R6.2 29.95,27.75 29.7,27.5 29.7,24 28.8,23.1 27.25,23.1 26.8,22.65 IC2.6
R  (via drill 0.3)
  Top 0.128: IC3.1 26.97,25.13 v26.79,25.07 | U1.63 21.65,26.33 v21.58,26.39
  Bottom 0.128: v21.58,26.39 23.66,26.39 24.15,25.91 25.95,25.91 v26.79,25.07
RAS  (via drill 0.3)
  Top 0.128: U1.52 21.68,20.83 v21.41,20.75
  Bottom 0.128: v21.41,20.75 21.41,20.76 21.65,21 23.05,21 27.95,16.1 v28.56,16.1 U$1.45 30.5,16 33,16 33.25,15.75 33.25,14 32.25,13 31,13 30.25,12.25 30.25,6.5 28.98,5.23 SOCK2.21
RD  (via drill 0.3)
  Top 0.128: U1.14 v10.7,25.83 v10.71,25.82 | SOCK1.33 6.12,45.12 5,44 5,42.5 4,41.5 2.25,41.5 1.25,40.5 1.25,22.33 1.25,19 2.88,17.37 v6.21,17.37
  Bottom 0.128: v10.71,25.82 10.71,23.33 7.86,20.48 7.86,18.95 6.28,17.37 v6.21,17.37 U$1.24
RDN  (via drill 0.3)
  Top 0.128: U1.78 20.48,32.95 v20.76,32.67 v20.77,32.67 | SOCK1.4 44.22,41.97 39,36.75 28.13,36.75 v27.55,36.16
  Bottom 0.128: 27.55,36.25 25.37,34.07 22.16,34.07 v20.77,32.67 | U$1.61 27.55,36.25 | 27.55,36.25 v27.55,36.16
RFSH  (via drill 0.3)
  Top 0.128: U1.28 10.48,17.58 9.95,17.05 9.13,17.05 v9.01,16.92
  Bottom 0.128: v9.01,16.92 9.01,16.1 8.5,15.59 v8.5,13.81 U$1.28 8.5,9.25 10,7.75 10,6.07 SOCK2.5
ROMCS  (via drill 0.3)
  Top 0.128: U1.39 15.98,19.42 v15.74,19.67 | SOCK2.16 21.36,8.53 17.39,12.5 v17.39,13.81
  Bottom 0.128: v15.74,19.67 15.74,18.83 15.23,18.32 15.23,15.27 16.12,14.38 16.88,14.38 17.39,13.88 v17.39,13.81 U$1.35
ROSCS  (via drill 0.3)
  Top 0.128: U1.40 16.48,19.69 v16.5,19.92 | SOCK2.3 6.12,4.87 7.25,6 22,6 22.5,6.5 22.5,12.51 v21.2,13.81
  Bottom 0.128: v16.5,19.92 16.45,19.85 16.25,19.65 16.25,19.35 18.23,17.37 18.23,16.27 19.93,14.57 20.94,14.57 21.2,14.32 v21.2,13.81 U$1.38
TCK  (via drill 0.3)
  Top 0.128: U1.48 20.48,30.83 22.85,33.2 23.7,33.2 24.1,32.85 X1.5 24.88,33 25.75,33 26.15,33.4 29.2,33.4 30.1,34.3 39.2,34.3 v40,33.5 | U$8.6 43.32,21.18 41.25,23.25 41.25,26.75 40,28 | 40,28 R19.2 | v40,28.75 40,28
  Bottom 0.128: v40,33.5 v40,28.75
TDI  (via drill 0.3)
  Top 0.128: U1.45 18.98,28.11 v19.5,28.62 | X1.3 26,30.85 v26.9,31.75 27.15,32 29.5,32 30.8,33.3 38.95,33.3 39.3,32.95 R16.1 41.5,31.5 42.75,30.25 42.75,27.22 U$8.10
  Route15 0.128: v26.9,31.75 26.5,31.3 25.1,31.3 23.4,29.6 23.4,27.7 22.85,27.15 20.6,27.15 19.5,28.25 v19.5,28.62
TDO  (via drill 0.3)
  Top 0.128: v18.34,31.42 17.98,31.82 17.98,32.82 U1.83 | X1.6 v25.85,33.85 26,34 28,34 28.65,34.65 v39.85,34.65 | 40.25,29.75 42.25,27.75 42.25,25.18 U$8.8 | R17.1 40.25,29.75 | 40.25,29.75 v40.5,30
  Bottom 0.128: v18.34,31.42 18.34,31.4 19.04,30.7 19.85,30.7 22.75,33.6 25.6,33.6 v25.85,33.85 | v40.5,30 40.5,34 v39.85,34.65
TMS  (via drill 0.3)
  Top 0.128: U1.47 19.98,29.25 v19.8,29.69 | X1.4 25.75,31.85 26.05,32.15 v26.05,32.55 27.8,32.55 28.35,33.1 29.8,33.1 30.5,33.8 v37.7,33.8 | U$8.4 42.36,18.64 39.5,21.5 39.5,26.05 R18.1 v40.5,26.25
  Bottom 0.128: v26.05,32.55 25.6,32.1 22.7,32.1 22.5,32.3 22,32.3 19.8,30.1 v19.8,29.69 | v40.5,26.25 39.75,26.25 39.25,26.75 39.25,32.25 v37.7,33.8
TPIN  (via drill 0.3)
  Top 0.128: U1.1 7.73,32.33 | 7.73,32.33 8,32.36 | 7.73,32.33 7.73,34.27 6.85,35.15 v6.21,35.15 6,35.36 6,37 7,38 18.5,38 22.5,42 22.5,43.25 23.9,44.65 SOCK1.19
  Bottom 0.128: U$1.10 v6.21,35.15
TPOUT  (via drill 0.3)
  Top 0.128: U1.64 23.98,26.83 v24,26.85 | v26.7,26.5 27.54,26.5 IC3.3
  Bottom 0.128: v24,26.85 24.6,26.25 26.45,26.25 v26.7,26.5
TS  (via drill 0.3)
  Top 0.128: U1.54 22.48,21.83 v22.3,22.01
  Bottom 0.128: v22.3,22.01 23.48,22.01 26.22,19.27 27.42,19.27 28.06,18.64 v28.56,18.64 U$1.47 32.61,18.64 34.25,17 34.25,10.5 32.75,9 32.75,5.96 SOCK2.23
WR  (via drill 0.3)
  Top 0.128: U1.46 v19.48,20.48 | SOCK2.28 36.6,6.85 35.75,6 25.75,6 25,6.75 25,12.53 v26.28,13.81
  Bottom 0.128: v19.48,20.48 20.62,19.34 23.59,19.34 26.28,16.66 v26.28,13.81 U$1.42
XTA0  (via drill 0.3)
  Top 0.128: IC4.3 12.1,15.99 R1.1 13.39,16 C10.2 13.42,16.39 13.64,16.61 15.29,16.61 15.45,16.45 16.5,16.45 16.6,16.35 v16.63,16.35
  Bottom 0.128: v16.63,16.35 17,16.35 18.7,14.65 19.25,14.65 19.93,13.97 v19.93,13.81 U$1.37 19.93,11.32 20,11.25 20,5.91 SOCK2.13
XTA1  (via drill 0.3)
  Top 0.128: R2.1 16.18,14.76 v16.31,14.89
  Bottom 0.128: v16.31,14.89 16.88,14.89 17.45,14.32 18.53,14.32 18.66,14.19 v18.66,13.81 U$1.36 18.66,7.43 SOCK2.14

### Text on the board
tPlace: 5060 | RD | CAS | BRHT | GND | MA6 | CLK | TPOU | TPIN | MUX | KB3 | KB2 | A3 | A1 | A2 | A6 | A7 | GND | A15 | A7RB | MA4 | D5 | D4 | MA5 | D3 | D0 | CSYNC | BC1 | KB0 | KB1 | A0 | A4 | CPUCLKB | BDIR | RDN | GND | JTAG | N/C | GND | N/C | GND | TDI | GND | TDO | GND | TCK | GND | TMS | GND | VREF | N/C | GND | D7 | A13 | AYCLK | MREQ | INT | XT2 | ROMCS | G | MWR | R | CAS1 | CAS2 | WR | MA1 | MA3 | MA0 | D1 | GND | ROCS | RFSH | A14 | IORQ | BE | XT1 | EXRM | B | KB4 | RAS | TS | MA2 | PWR5 | MA7 | D6 | D2 | A5
bPlace: Timex TS2068 / Prototype Board / (C) 2022 Alvaro Lopes